# Altium schematic sheet BMS_Cell.SchDoc: CELL BALANCE
size A2; CompanyName: TAISAT; DrawnBy: Alperen Fenerci; Organization: GREENGUARD; SheetNumber: 1; SheetTotal: 2
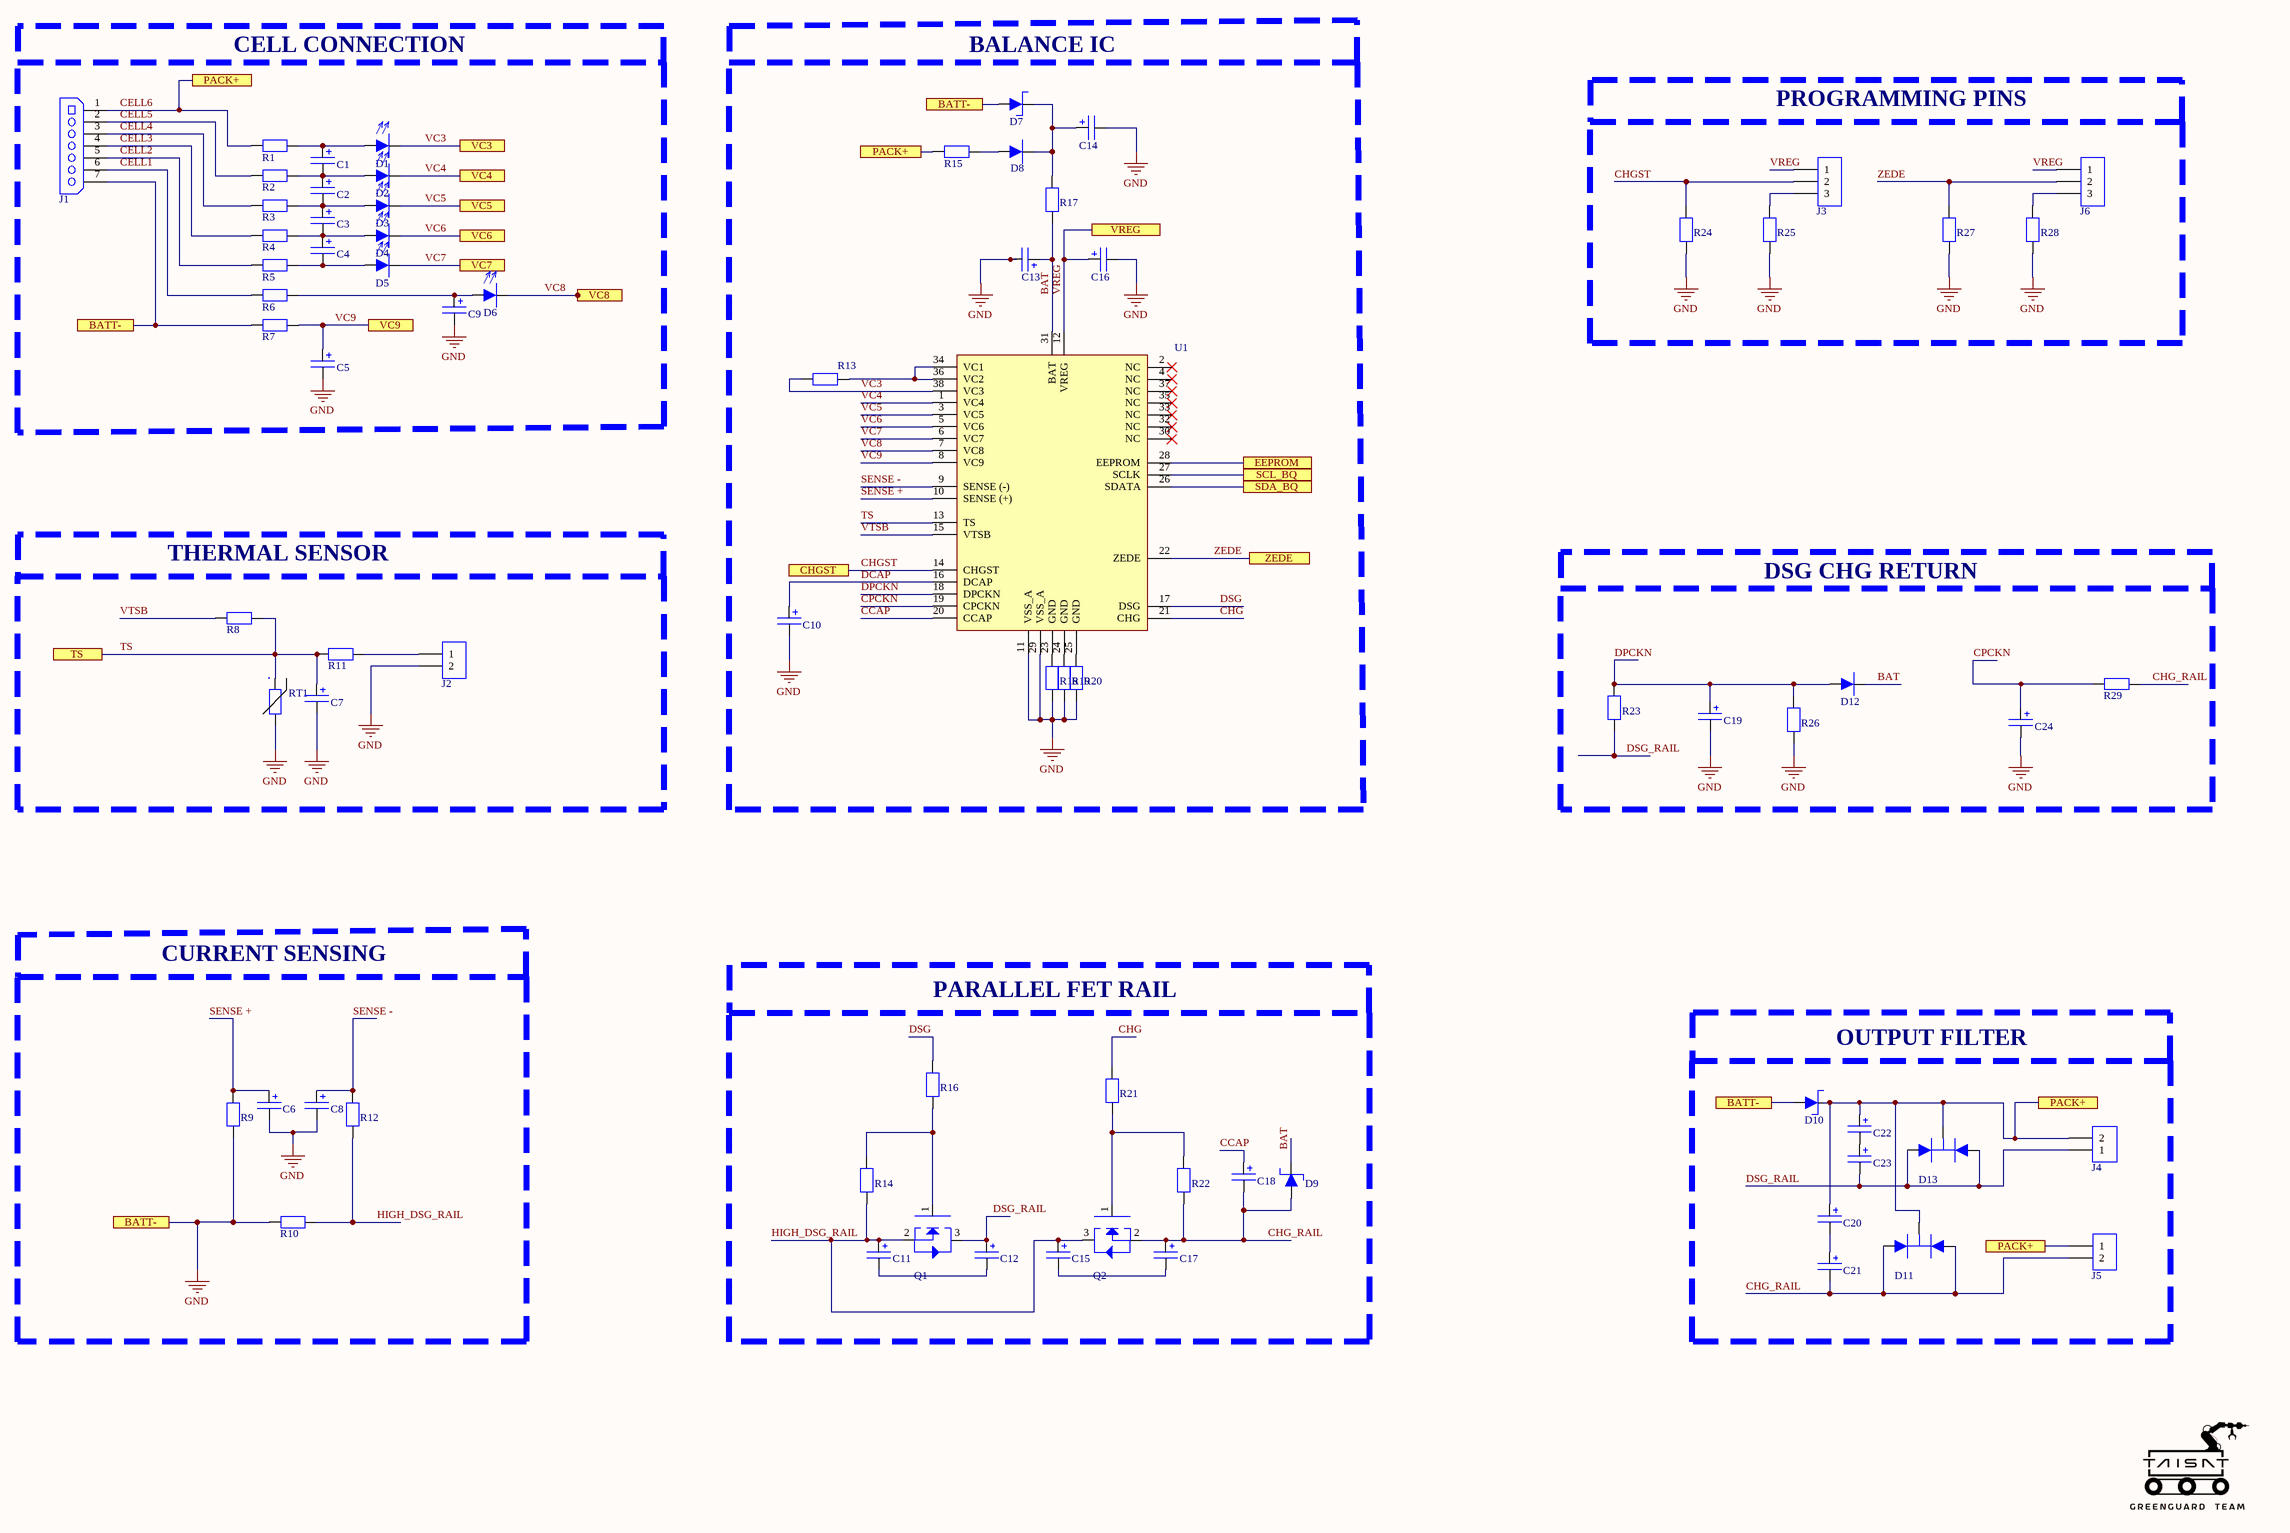
[diagram p0: BMS_Cell.SchDoc]

## Parts
C1  1uF  [CAP 0805]  (value not drawn)
C2  1uF  [CAP 0805]  (value not drawn)
C3  1uF  [CAP 0805]  (value not drawn)
C4  1uF  [CAP 0805]  (value not drawn)
C5  1uF  [CAP 0805]  (value not drawn)
C6  0.1uF  [CAP 0603]  (value not drawn)
C7  10nF  [CAP 0603]  (value not drawn)
C8  0.1uF  [CAP 0603]  (value not drawn)
C9  1uF  [CAP 0805]  (value not drawn)
C10  1uF  [CAP 0603]  (value not drawn)
C11  0.1uF  [CAP 0603]  (value not drawn)
C12  0.1uF  [CAP 0603]  (value not drawn)
C13  0.1uF  [CAP 0603]  (value not drawn)
C14  10uF  [CAP 0603]  (value not drawn)
C15  0.1uF  [CAP 0603]  (value not drawn)
C16  4.7uF  [CAP 0603]  (value not drawn)
C17  0.1uF  [CAP 0603]  (value not drawn)
C18  1uF  [CAP 0603]  (value not drawn)
C19  0.1uF  [CAP 0603]  (value not drawn)
C20  0.1uF  [CAP 0603]  (value not drawn)
C21  0.1uF  [CAP 0603]  (value not drawn)
C22  0.1uF  [CAP 0603]  (value not drawn)
C23  0.1uF  [CAP 0603]  (value not drawn)
C24  0.1uF  [CAP 0603]  (value not drawn)
D1  LTW-C191TLA  [LED 0603]  (value not drawn)
D2  LTW-C191TLA  [LED 0603]  (value not drawn)
D3  LTW-C191TLA  [LED 0603]  (value not drawn)
D4  LTW-C191TLA  [LED 0603]  (value not drawn)
D5  LTW-C191TLA  [LED 0603]  (value not drawn)
D6  LTW-C191TLA  [LED 0603]  (value not drawn)
D7  SMAJ36A-HT  [DO214AC]  (value not drawn)
D8  1N4148WS-HT  [SOD323]  (value not drawn)
D9  SMAJ36A-HT  [DO214AC]  (value not drawn)
D10  SMAJ36A-HT  [DO214AC]  (value not drawn)
D11  BYQ28ED  [DPAK]  (value not drawn)
D12  1N4148WS-HT  [SOD323]  (value not drawn)
D13  BYQ28ED  [DPAK]  (value not drawn)
J1  JST-XH-7  [JST-XH-7]  (value not drawn)
J2  146285-2  [HEADER 1x2]  (value not drawn)
J3  146285-3  [HEADER 1x3]  (value not drawn)
J4  282845-2  [Terminal 1x2]  (value not drawn)
J5  282845-2  [Terminal 1x2]  (value not drawn)
J6  146285-3  [HEADER 1x3]  (value not drawn)
Q1  IRF540SPBF  [D2PAK-3]  (value not drawn)
Q2  IRF540SPBF  [D2PAK-3]  (value not drawn)
R1  500R  [RESISTOR 1206]  (value not drawn)
R2  500R  [RESISTOR 1206]  (value not drawn)
R3  500R  [RESISTOR 1206]  (value not drawn)
R4  500R  [RESISTOR 1206]  (value not drawn)
R5  500R  [RESISTOR 1206]  (value not drawn)
R6  500R  [RESISTOR 1206]  (value not drawn)
R7  500R  [RESISTOR 1206]  (value not drawn)
R8  10K  [RESISTOR 0603]  (value not drawn)
R9  1K  [RESISTOR 0603]  (value not drawn)
R10  0.002R Shunt  [RESISTOR 2512]  (value not drawn)
R11  50R  [RESISTOR 0603]  (value not drawn)
R12  1K  [RESISTOR 0603]  (value not drawn)
R13  100R  [RESISTOR 0603]  (value not drawn)
R14  5.1M  [RESISTOR 0603]  (value not drawn)
R15  200R  [RESISTOR 0603]  (value not drawn)
R16  1K  [RESISTOR 0603]  (value not drawn)
R17  100R  [RESISTOR 0603]  (value not drawn)
R18  1K  [RESISTOR 0603]  (value not drawn)
R19  1K  [RESISTOR 0603]  (value not drawn)
R20  1K  [RESISTOR 0603]  (value not drawn)
R21  1K  [RESISTOR 0603]  (value not drawn)
R22  5.1M  [RESISTOR 0603]  (value not drawn)
R23  100R  [RESISTOR 0603]  (value not drawn)
R24  1K  [RESISTOR 0603]  (value not drawn)
R25  1K  [RESISTOR 0603]  (value not drawn)
R26  47K  [RESISTOR 0603]  (value not drawn)
R27  1K  [RESISTOR 0603]  (value not drawn)
R28  1K  [RESISTOR 0603]  (value not drawn)
R29  100R  [RESISTOR 0603]  (value not drawn)
RT1  10K  [NTC 0603]  (value not drawn)
U1  BQ77908  [TSSOP-38]  (value not drawn)

## Ports
BATT- (see BMS_Cell[2B], BMS_Cell[2C], BMS_Cell[4A]), BATT- (see BMS_Cell[2B], BMS_Cell[2C], BMS_Cell[7C]), BATT- (see BMS_Cell[2B], BMS_Cell[4A], BMS_Cell[7C]), BATT- (see BMS_Cell[2C], BMS_Cell[4A], BMS_Cell[7C]), CHGST (see BMS_MCU[6A]), EEPROM (see BMS_MCU[6A]), PACK+ (see BMS_Cell[2A], BMS_Cell[4A], BMS_Cell[7C], BMS_MCU[1A], BMS_MCU[1B], BMS_MCU[1C]), PACK+ (see BMS_Cell[2A], BMS_Cell[4A], BMS_Cell[7D], BMS_MCU[1A], BMS_MCU[1B], BMS_MCU[1C]), PACK+ (see BMS_Cell[2A], BMS_Cell[7C], BMS_Cell[7D], BMS_MCU[1A], BMS_MCU[1B], BMS_MCU[1C]), PACK+ (see BMS_Cell[4A], BMS_Cell[7C], BMS_Cell[7D], BMS_MCU[1A], BMS_MCU[1B], BMS_MCU[1C]), SCL_BQ (see BMS_MCU[6A]), SDA_BQ (see BMS_MCU[6A]), TS, VC3 (see BMS_MCU[1A]), VC4 (see BMS_MCU[1A]), VC5 (see BMS_MCU[1A]), VC6 (see BMS_MCU[1A], BMS_MCU[1B]), VC7 (see BMS_MCU[1B]), VC8 (see BMS_MCU[1B]), VC9 (see BMS_MCU[1B]), VREG, ZEDE (see BMS_MCU[6A])

## Nets
GND: C5.2 C6.2 C7.2 C8.2 C9.2 C10.2 C13.2 C14.2 C16.2 C19.2 C24.2 D7.2 D10.2 J1.7 J2.2 R7.1 R9.1 R10.1 R18.1 R19.1 R20.1 R24.1 R25.1 R26.1 R27.1 R28.1 RT1.2 U1.11(VSS_A) U1.29(VSS_A) ; port BATT-
BAT: C13.1 D9.1 D12.1 R17.1 U1.31(BAT)
CCAP: C18.1 U1.20(CCAP)
CELL1: J1.6 R6.1
CELL2: J1.5 R5.1
CELL3: J1.4 R4.1
CELL4: J1.3 R3.1
CELL5: J1.2 R2.1
CELL6: C20.1 C22.1 D10.1 D11.2(K) D13.2(K) J1.1 J4.2 J5.1 R1.1 R15.2 ; port PACK+
CHG: R21.2 U1.21(CHG)
CHG_RAIL: C17.1 C18.2 C21.2 D9.2 D11.1(A1) D11.3(A2) J5.2 Q2.2(S) R22.1 R29.1
CHGST: J3.2 R24.2 U1.14(CHGST) ; port CHGST
CPCKN: C24.1 R29.2 U1.19(CPCKN)
DCAP: C10.1 U1.16(DCAP)
DPCKN: C19.1 D12.2 R23.2 R26.2 U1.18(DPCKN)
DSG: R16.2 U1.17(DSG)
DSG_RAIL: C12.1 C23.2 D13.1(A1) D13.3(A2) J4.1 Q1.3(D) R23.1
EEPROM: U1.28(EEPROM) ; port EEPROM
HIGH_DSG_RAIL: C11.1 C15.1 Q1.2(S) Q2.3(D) R10.2 R12.1 R14.1
SCL_BQ: U1.27(SCLK) ; port SCL_BQ
SDA_BQ: U1.26(SDATA) ; port SDA_BQ
SENSE +: C6.1 R9.2 U1.10(SENSE_(+))
SENSE -: C8.1 R12.2 U1.9(SENSE_(-))
TS: C7.1 R8.2 R11.1 RT1.1 U1.13(TS) ; port TS
VC3: D1.1 R13.1 U1.38(VC3) ; port VC3
VC4: D2.1 U1.1(VC4) ; port VC4
VC5: D3.1 U1.3(VC5) ; port VC5
VC6: D4.1 U1.5(VC6) ; port VC6
VC7: D5.1 U1.6(VC7) ; port VC7
VC8: D6.1 U1.7(VC8) ; port VC8
VC9: C5.1 R7.2 U1.8(VC9) ; port VC9
VREG: C16.1 J3.1 J6.1 U1.12(VREG) ; port VREG
VTSB: R8.1 U1.15(VTSB)
ZEDE: J6.2 R27.2 U1.22(ZEDE) ; port ZEDE
NetC1_1: C1.1 D1.2 R1.2
NetC1_2: C1.2 C2.1 D2.2 R2.2
NetC2_2: C2.2 C3.1 D3.2 R3.2
NetC3_2: C3.2 C4.1 D4.2 R4.2
NetC4_2: C4.2 D5.2 R5.2
NetC9_1: C9.1 D6.2 R6.2
NetC11_2: C11.2 C12.2
NetC14_1: C14.1 D7.1 D8.1 R17.2
NetC15_2: C15.2 C17.2
NetC20_2: C20.2 C21.1
NetC22_2: C22.2 C23.1
NetD8_2: D8.2 R15.1
NetJ2_1: J2.1 R11.2
NetJ3_3: J3.3 R25.2
NetJ6_3: J6.3 R28.2
NetQ1_1: Q1.1(G) R14.2 R16.1
NetQ2_1: Q2.1(G) R21.1 R22.2
NetR13_2: R13.2 U1.34(VC1) U1.36(VC2)
NetR18_2: R18.2 U1.23(GND)
NetR19_2: R19.2 U1.24(GND)
NetR20_2: R20.2 U1.25(GND)

Not connected (* = marked no-connect by the designer): U1 2(NC)* 4(NC)* 30(NC)* 32(NC)* 33(NC)* 35(NC)* 37(NC)*

## Notes on the sheet
- CELL CONNECTION
- BALANCE IC
- PROGRAMMING PINS
- THERMAL SENSOR
- DSG CHG RETURN
- CURRENT SENSING
- PARALLEL FET RAIL
- OUTPUT FILTER
- Proje Adı / Project Name
- Dosya Adı / File Name
- Sayfa Adı / Sheet Name
- Şirket Adı / Company Name
- Tasarlayan / Designed By
- Takım / Team
- Kontrol Eden / Checked By
- Başlangıç Tarihi / Start Date
- Revize Tarihi / Revision Date
- Onaylayan / Approved By
- Sayfa / Sheet

## Library data of the parts
C1-C5 C9 = CAP 0805: Multilayer Ceramic Capacitor; Manufacturer: KEMET; Manufacturer Part Number: C0805C224K5RACTU; Material: 4241ConductorMaterial; Value: 220nF; Voltage Rating: 50V; Tolerance: 10%; Dielectric: X7R; Dissipation Factor: 2.5%; Temperature Coefficient: 30ppm/°C; Supplier: Mouser; Supplier Part Number: 80-C0805C224K5R; RoHS: Yes; Category: Ceramic Capacitors; Stock: 89467; Pricing: 1=0.15, 10=0.084, 50=0.084, 100=0.053, 1000=0.035, 10000=0.026 (USD); Mounting Technology: Surface Mount,PCB; Case/Package: 0805; Case Code (Metric): 2012; Case Code (Imperial): 0805; Dielectric Material: Ceramic; Min Operating Temperature: -55°C; Max Operating Temperature: 125°C; Package Quantity: 4000; Packaging: Tape and Reel; Voltage Rating (DC): 50V; Termination: SMD/SMT; Series: SMD Comm X7R; Construction: Flat; Voltage: 50V; Length: 2mm; Width: 1.2mm; Height: 1.1mm; Depth: 1.25mm; Lead Pitch: 0.75mm; Radiation Hardening: No; RoHS Compliant: Yes; Reach SVHC Compliant: No; Lead Free: 5697LeadFree; Created By: Kaptanyum
C6 C8 C10-C24 = CAP 0603: Multilayer Ceramic Capacitor; Manufacturer: KEMET; Manufacturer Part Number: C0603C103K5RACTU; Material: 4241ConductorMaterial; Value: 10nF; Tolerance: 10%; Voltage Rating: 50V; Dielectric: X7R; Dissipation Factor: 2.5%; Temperature Coefficient: 30ppm/°C; Supplier: Mouser; Supplier Part Number: 80-C0603C103K5R; RoHS: Yes; Category: Ceramic Capacitors; Stock: 1110922; Pricing: 1=0.1, 10=0.047, 50=0.047, 100=0.026, 1000=0.017, 10000=0.012 (USD); Mounting Technology: PCB,Surface Mount; Case/Package: 0603; Pins: 2; Case Code (Metric): 1608; Case Code (Imperial): 0603; Min Operating Temperature: -55°C; Max Operating Temperature: 125°C; Voltage Rating (DC): 50V; Packaging: Tape and Reel; Package Quantity: 4000; Termination: SMD/SMT; Series: C0603C; Construction: Flat; Voltage: 50V; Length: 1.6mm; Width: 0.8mm; Height: 0.8mm; Depth: 0.8mm; Lead Pitch: 0.7mm; Radiation Hardening: No; RoHS Compliant: Yes; Reach SVHC Compliant: No; Lead Free: 5697LeadFree; Created By: Kaptanyum
C7 = CAP 0603: Multilayer Ceramic Capacitor; Manufacturer: KEMET; Manufacturer Part Number: C0603C103K5RACTU; Material: 4241ConductorMaterial; Tolerance: 10%; Voltage Rating: 50V; Dielectric: X7R; Dissipation Factor: 2.5%; Temperature Coefficient: 30ppm/°C; Supplier: Mouser; Supplier Part Number: 80-C0603C103K5R; RoHS: Yes; Category: Ceramic Capacitors; Stock: 1110922; Pricing: 1=0.1, 10=0.047, 50=0.047, 100=0.026, 1000=0.017, 10000=0.012 (USD); Mounting Technology: PCB,Surface Mount; Case/Package: 0603; Pins: 2; Case Code (Metric): 1608; Case Code (Imperial): 0603; Min Operating Temperature: -55°C; Max Operating Temperature: 125°C; Value: 10nF; Voltage Rating (DC): 50V; Packaging: Tape and Reel; Package Quantity: 4000; Termination: SMD/SMT; Series: C0603C; Construction: Flat; Voltage: 50V; Length: 1.6mm; Width: 0.8mm; Height: 0.8mm; Depth: 0.8mm; Lead Pitch: 0.7mm; Radiation Hardening: No; RoHS Compliant: Yes; Reach SVHC Compliant: No; Lead Free: 5697LeadFree; Created By: Kaptanyum
D1-D6 = LED 0603: Chip LED; Manufacturer: Vishay Lite-On; Manufacturer Part Number: LTST-C190GKT; Color: Green; Lens Color: Colorless; Luminous Intensity: 6mcd; Forward Voltage: 2.1V; Viewing Angle: 130°; Lens Style: Flat,Diffused,Colorless,Rectangular,Clear; Forward Current: 30mA; Dominant Wavelength: 569nm; Test Current: 10mA; Wavelength: 565nm; Power Dissipation: 100mW; Number of LEDs: 1; Reverse Voltage: 5V; Lens Transparency: Clear; Voltage: 2V; Lens Size: 0.8mm; Supplier: Arrow Electronics; Supplier Part Number: LTST-C190GKT; RoHS: Yes; Category: LEDs; Stock: 36000; Pricing: 4000=0.0455, 12000=0.034, 100000=0.0267 (USD); Mounting Technology: Surface Mount; Case/Package: 0603; Pins: 2; Case Code (Metric): 1608; Case Code (Imperial): 0603; Min Operating Temperature: -55°C; Max Operating Temperature: 85°C; Packaging: Tape and Reel; Package Quantity: 1; Series: -; Illumination Color: Green; Power Rating: 100mW; Number of Elements: 1; Length: 1.6mm; Width: 0.8mm; Height: 0.9mm; Depth: 0.8mm; Radiation Hardening: No; Lead Free: Lead Free; RoHS Compliant: Yes; ComponentLink1URL: https://datasheet.ciiva.com/2109/ltst-c190gkt-2109985.pdf?src-supplier=Digi-Key; ComponentLink1Description: https://datasheet.ciiva.com/2109/ltst-c190gkt-2109985.pdf?src-supplier=Digi-Key; ComponentLink2URL: https://datasheet.ciiva.com/11775/0900766b80dc02a6-11775616.pdf?src-supplier=Rs; ComponentLink2Description: https://datasheet.ciiva.com/11775/0900766b80dc02a6-11775616.pdf?src-supplier=Rs; ComponentLink3URL: https://datasheet.ciiva.com/12403/lite-on-ltst-c190gkt-187204-12403884.pdf?src-supplier=Mouser; ComponentLink3Description: https://datasheet.ciiva.com/12403/lite-on-ltst-c190gkt-187204-12403884.pdf?src-supplier=Mouser; ComponentLink4URL: https://datasheet.ciiva.com/16392/lite-on20ltst-c190gkt-16392818.pdf?src-supplier=Future+Electronics; ComponentLink4Description: https://datasheet.ciiva.com/16392/lite-on20ltst-c190gkt-16392818.pdf?src-supplier=Future+Electronics; ComponentLink5URL: https://datasheet.ciiva.com/2109/ltst-c190gkt-2109986.pdf?src-supplier=Digi-Key; ComponentLink5Description: https://datasheet.ciiva.com/2109/ltst-c190gkt-2109986.pdf?src-supplier=Digi-Key; ComponentLink6URL: https://datasheet.ciiva.com/2109/ltst-c190gkt-2109987.pdf?src-supplier=Digi-Key; ComponentLink6Description: https://datasheet.ciiva.com/2109/ltst-c190gkt-2109987.pdf?src-supplier=Digi-Key; Created By: Kaptanyum
D7 D9 D10 = SMAJ36A-HT: Diode TVS 36V; Manufacturer: Vishay Semiconductors; Manufacturer Part Number: SMAJ36AHE3/61; Peak Pulse Power: 400W; Breakdown Voltage: 40V; Polarity: Unidirectional; Peak Pulse Current: 6.9A; Clamping Voltage: 58.1V; Power Line Protection: No; Diode Type: ZENER; Number of Unidirectional Channels: 1; Test Current: 1mA; Max Breakdown Voltage: 44.2V; Max Reverse Leakage Current: 1uA; Max Forward Surge Current (Ifsm): 40A; Supplier: Digi-Key; Supplier Part Number: SMAJ36AHE3/61DKR-ND; RoHS: Yes; Category: TVS Diodes; Case/Package: DO-214AC; Pins: 2; Min Operating Temperature: -55°C; Max Operating Temperature: 150°C; Packaging: Tape and Reel; Reverse Standoff Voltage: 36V; Min Breakdown Voltage: 40V; Package Quantity: 1800; Max Surge Current: 6.9A; Series: Automotive, AEC-Q101, TransZorb®; Termination: SMD/SMT; Max Power Dissipation: 400W; Operating Supply Voltage: 36V; Number of Channels: 1; Direction: Unidirectional; Power Dissipation: 400W; Clamping Voltage-Max: 58.1V; RoHS Compliant: Yes; Lead Free: Lead Free; ComponentLink1URL: http://www.mouser.com/ds/2/427/smaj50a-241759.pdf?src-supplier=Mouser; ComponentLink1Description: http://www.mouser.com/ds/2/427/smaj50a-241759.pdf?src-supplier=Mouser; ComponentLink2URL: http://www.vishay.com/docs/88390/smaj50a.pdf?src-supplier=Digi-Key; ComponentLink2Description: http://www.vishay.com/docs/88390/smaj50a.pdf?src-supplier=Digi-Key; ComponentLink3URL: http://www.vishay.com/docs/88390/88390.pdf?src-supplier=Avnet; ComponentLink3Description: http://www.vishay.com/docs/88390/88390.pdf?src-supplier=Avnet; ComponentLink4URL: http://www.vishay.com/doc?88390?src-supplier=Future+Electronics; ComponentLink4Description: http://www.vishay.com/doc?88390?src-supplier=Future+Electronics
D8 D12 = 1N4148WS-HT: Diode Switch 75V
D11 D13 = BYQ28ED: Diode Array Rectifier; Manufacturer: NXP Semiconductors; Manufacturer Part Number: BYQ28ED-200/T3; Max Reverse Current: 10uA; Max Surge Current: 55A; Recovery Time: 25ns; Reverse Voltage: 200V; Supplier: Mouser; Supplier Part Number: 771-BYQ28ED-200/T3; RoHS: Yes; Category: Uncategorized; Case/Package: DPAK; Min Operating Temperature: -40°C; Max Operating Temperature: 150°C; Packaging: Tape and Reel; Package Quantity: 2500; RoHS Compliant: Yes; ComponentLink1URL: http://www.nxp.com/pip/BYQ28ED-200?src-supplier=Mouser; ComponentLink1Description: http://www.nxp.com/pip/BYQ28ED-200?src-supplier=Mouser; Created By: Kaptanyum
J1 = JST-XH-7: JST Socket for PCB; Manufacturer Part Number: B4B-XH-A(LF)(SN); Gender: Male; Contact Resistance: 20mR; Max Current Rating: 3A; Voltage Rating: 250V; Number of Positions: 4; Connector Type: Header; Insulation Resistance: 1GR; Pitch: 2.5mm; Mated Stacking Heights: 9.8mm; Wire/Cable Gauge: 22AWG; Supplier: Arrow Electronics; Supplier Part Number: B4B-XH-A(LF)(SN); Manufacturer: JST; RoHS: Yes; Category: Headers and Wire Housings; Stock: 46264; Pricing: 1=0.1585, 10=0.1388, 25=0.1373, 50=0.1359, 100=0.0728 (USD); Mounting Technology: Through Hole; Contact Plating: Tin,Lead,Copper; Contact Material: Brass; Housing Color: White; Housing Material: Polyamide; Contact Shape: Square; Contact Finish - Mating: TIN; Insulation Material: Nylon; Insulation Color: Natural; Color: Natural; Material: Polyamide; Min Operating Temperature: -25°C; Max Operating Temperature: 85°C; Number of Rows: 1; Termination: Solder; Series: XH; Packaging: Bulk; Max Voltage Rating (AC): 250V; Number of Contacts: 4; Orientation: Straight; Contact Type: Male Pin; Fastening Type: Detent; Current Rating: 3A; Voltage Rating (AC): 250V; Max Voltage Rating (DC): 250V; Length: 12.4mm; Depth: 5.75mm; Lead Pitch: 2.5mm; Reach SVHC Compliant: No; Lead Free: Lead Free; Flammability Rating: UL94 V-0; ComponentLink1URL: https://datasheet.ciiva.com/16203/b4b-xh-alfsn-16203642.pdf?src-supplier=Future+Electronics; ComponentLink1Description: https://datasheet.ciiva.com/16203/b4b-xh-alfsn-16203642.pdf?src-supplier=Future+Electronics; ComponentLink2URL: https://datasheet.ciiva.com/26894/getdatasheetpartid-455616-26894787.pdf?src-supplier=Verical; ComponentLink2Description: https://datasheet.ciiva.com/26894/getdatasheetpartid-455616-26894787.pdf?src-supplier=Verical; ComponentLink3URL: https://datasheet.ciiva.com/26924/getdatasheetpartid-640571-26924035.pdf?src-supplier=Verical; ComponentLink3Description: https://datasheet.ciiva.com/26924/getdatasheetpartid-640571-26924035.pdf?src-supplier=Verical; ComponentLink4URL: https://datasheet.ciiva.com/726/exh-726404.pdf?src-supplier=Digi-Key; ComponentLink4Description: https://datasheet.ciiva.com/726/exh-726404.pdf?src-supplier=Digi-Key; Created By: Kaptanyum
J2 = HEADER 1x2: Header for PCB; Manufacturer: JST; Manufacturer Part Number: B4B-XH-A(LF)(SN); Gender: Male; Contact Resistance: 20mR; Max Current Rating: 3A; Voltage Rating: 250V; Number of Positions: 4; Insulation Resistance: 1GR; Pitch: 2.5mm; Mated Stacking Heights: 9.8mm; Wire/Cable Gauge: 22AWG; Supplier: Arrow Electronics; Supplier Part Number: B4B-XH-A(LF)(SN); RoHS: Yes; Category: Headers and Wire Housings; Stock: 46264; Pricing: 1=0.1585, 10=0.1388, 25=0.1373, 50=0.1359, 100=0.0728 (USD); Mounting Technology: Through Hole; Contact Plating: Tin,Lead,Copper; Contact Material: Brass; Housing Color: White; Housing Material: Polyamide; Contact Shape: Square; Contact Finish - Mating: TIN; Insulation Material: Nylon; Insulation Color: Natural; Color: Natural; Material: Polyamide; Min Operating Temperature: -25°C; Max Operating Temperature: 85°C; Number of Rows: 1; Termination: Solder; Series: XH; Packaging: Bulk; Max Voltage Rating (AC): 250V; Number of Contacts: 4; Orientation: Straight; Connector Type: Header; Contact Type: Male Pin; Fastening Type: Detent; Current Rating: 3A; Voltage Rating (AC): 250V; Max Voltage Rating (DC): 250V; Length: 12.4mm; Depth: 5.75mm; Lead Pitch: 2.5mm; Reach SVHC Compliant: No; Lead Free: Lead Free; Flammability Rating: UL94 V-0; ComponentLink1URL: https://datasheet.ciiva.com/16203/b4b-xh-alfsn-16203642.pdf?src-supplier=Future+Electronics; ComponentLink1Description: https://datasheet.ciiva.com/16203/b4b-xh-alfsn-16203642.pdf?src-supplier=Future+Electronics; ComponentLink2URL: https://datasheet.ciiva.com/26894/getdatasheetpartid-455616-26894787.pdf?src-supplier=Verical; ComponentLink2Description: https://datasheet.ciiva.com/26894/getdatasheetpartid-455616-26894787.pdf?src-supplier=Verical; ComponentLink3URL: https://datasheet.ciiva.com/26924/getdatasheetpartid-640571-26924035.pdf?src-supplier=Verical; ComponentLink3Description: https://datasheet.ciiva.com/26924/getdatasheetpartid-640571-26924035.pdf?src-supplier=Verical; ComponentLink4URL: https://datasheet.ciiva.com/726/exh-726404.pdf?src-supplier=Digi-Key; ComponentLink4Description: https://datasheet.ciiva.com/726/exh-726404.pdf?src-supplier=Digi-Key; Created By: Kaptanyum
J3 J6 = HEADER 1x3: Header for PCB; Manufacturer: JST; Manufacturer Part Number: B4B-XH-A(LF)(SN); Gender: Male; Contact Resistance: 20mR; Max Current Rating: 3A; Voltage Rating: 250V; Number of Positions: 4; Insulation Resistance: 1GR; Pitch: 2.5mm; Mated Stacking Heights: 9.8mm; Wire/Cable Gauge: 22AWG; Supplier: Arrow Electronics; Supplier Part Number: B4B-XH-A(LF)(SN); RoHS: Yes; Category: Headers and Wire Housings; Stock: 46264; Pricing: 1=0.1585, 10=0.1388, 25=0.1373, 50=0.1359, 100=0.0728 (USD); Mounting Technology: Through Hole; Contact Plating: Tin,Lead,Copper; Contact Material: Brass; Housing Color: White; Housing Material: Polyamide; Contact Shape: Square; Contact Finish - Mating: TIN; Insulation Material: Nylon; Insulation Color: Natural; Color: Natural; Material: Polyamide; Min Operating Temperature: -25°C; Max Operating Temperature: 85°C; Number of Rows: 1; Termination: Solder; Series: XH; Packaging: Bulk; Max Voltage Rating (AC): 250V; Number of Contacts: 4; Orientation: Straight; Connector Type: Header; Contact Type: Male Pin; Fastening Type: Detent; Current Rating: 3A; Voltage Rating (AC): 250V; Max Voltage Rating (DC): 250V; Length: 12.4mm; Depth: 5.75mm; Lead Pitch: 2.5mm; Reach SVHC Compliant: No; Lead Free: Lead Free; Flammability Rating: UL94 V-0; ComponentLink1URL: https://datasheet.ciiva.com/16203/b4b-xh-alfsn-16203642.pdf?src-supplier=Future+Electronics; ComponentLink1Description: https://datasheet.ciiva.com/16203/b4b-xh-alfsn-16203642.pdf?src-supplier=Future+Electronics; ComponentLink2URL: https://datasheet.ciiva.com/26894/getdatasheetpartid-455616-26894787.pdf?src-supplier=Verical; ComponentLink2Description: https://datasheet.ciiva.com/26894/getdatasheetpartid-455616-26894787.pdf?src-supplier=Verical; ComponentLink3URL: https://datasheet.ciiva.com/26924/getdatasheetpartid-640571-26924035.pdf?src-supplier=Verical; ComponentLink3Description: https://datasheet.ciiva.com/26924/getdatasheetpartid-640571-26924035.pdf?src-supplier=Verical; ComponentLink4URL: https://datasheet.ciiva.com/726/exh-726404.pdf?src-supplier=Digi-Key; ComponentLink4Description: https://datasheet.ciiva.com/726/exh-726404.pdf?src-supplier=Digi-Key; Created By: Kaptanyum
J4 J5 = SCREW TERMINAL: 7.62mm 2 POS; Created By: Kaptanyum
Q1 Q2 = IRF540SPBF: MOSFET N-ch, 100V 28A
R1-R7 = RES 1206: SMD Chip Resistor; Manufacturer: Yageo; Manufacturer Part Number: RC1206FR-074K7L; Voltage Rating: 200V; Value: 4.7kR; Power Rating: 250mW; Temperature Coefficient: 100ppm/°C; Tolerance: 1%; Supplier: Future Electronics; Supplier Part Number: 2668689; RoHS: Yes; Category: Chip SMD Resistors; Stock: 240000; Pricing: 5000=0.0048, 25000=0.0045, 100000=0.0043, 250000=0.0041, 625000=0.0038 (USD); Case/Package: 1206; Pins: 2; Case Code (Imperial): 1206; Case Code (Metric): 3216; Min Operating Temperature: -55°C; Max Operating Temperature: 155°C; Packaging: Tape and Reel; Resistor Type: Thick Film; Voltage Rating (DC): 200V; Series: RC02H; Resistance Tolerance: 1%; Voltage Rating (AC): 200V; Width: 1.6mm; RoHS Compliant: Yes; Reach SVHC Compliant: Unknown; Lead Free: Lead Free; Created By: Kaptanyum
R8 R9 R11-R29 = RES 0603: SMD Chip Resistor; Manufacturer: Yageo; Manufacturer Part Number: AC0603FR-071KL; Tolerance: 1%; Value: 1kR; Power Rating: 100mW; Voltage Rating: 50V; Temperature Coefficient: 100ppm/°C; Supplier: Future Electronics; Supplier Part Number: 1029290; RoHS: Yes; Category: Chip SMD Resistors; Stock: 1025000; Pricing: 5000=0.0021, 25000=0.0019, 150000=0.0018, 500000=0.0017, 1500000=0.0016 (USD); Case/Package: 0603; Case Code (Metric): 1608; Case Code (Imperial): 0603; Min Operating Temperature: -55°C; Max Operating Temperature: 155°C; Packaging: Tape and Reel; Package Quantity: 1; Number of Terminations: 2; Termination: SMD/SMT; Max Power Dissipation: 100mW; Features: Moisture Resistant,Automotive AEC-Q200,Anti-Sulfur; Series: AC; Length: 0.063inch; Width: 0.031inch; Height: 0.022inch; Ratings: AEC-Q200; Lead Free: Lead Free; RoHS Compliant: Yes; ComponentLink1URL: https://datasheet.ciiva.com/5558/pyu-ac-51-rohs-l-2-5558269.pdf?src-supplier=Mouser; ComponentLink1Description: https://datasheet.ciiva.com/5558/pyu-ac-51-rohs-l-2-5558269.pdf?src-supplier=Mouser; Created By: Kaptanyum
R10 = RES 2512: SMD Chip Resistor; Manufacturer: Yageo; Manufacturer Part Number: RC1206FR-074K7L; Voltage Rating: 200V; Value: 4.7kR; Power Rating: 250mW; Temperature Coefficient: 100ppm/°C; Tolerance: 1%; Supplier: Future Electronics; Supplier Part Number: 2668689; RoHS: Yes; Category: Chip SMD Resistors; Stock: 240000; Pricing: 5000=0.0048, 25000=0.0045, 100000=0.0043, 250000=0.0041, 625000=0.0038 (USD); Case/Package: 1206; Pins: 2; Case Code (Imperial): 1206; Case Code (Metric): 3216; Min Operating Temperature: -55°C; Max Operating Temperature: 155°C; Packaging: Tape and Reel; Resistor Type: Thick Film; Voltage Rating (DC): 200V; Series: RC02H; Resistance Tolerance: 1%; Voltage Rating (AC): 200V; Width: 1.6mm; RoHS Compliant: Yes; Reach SVHC Compliant: Unknown; Lead Free: Lead Free; Created By: Kaptanyum
RT1 = NTC 0603: Thermistor NTC; Manufacturer: Panasonic; Manufacturer Part Number: ERT-J1VG103FA; Value: 10kR; Tolerance: 1%; Max Power Dissipation: 100mW; Supplier: Mouser; Supplier Part Number: 667-ERT-J1VG103FA; RoHS: Yes; Category: Thermistors; Stock: 91891; Pricing: 1=0.2, 10=0.141, 50=0.141, 100=0.12, 1000=0.09, 10000=0.077 (USD); Mounting Technology: Surface Mount; Case/Package: 0603; Pins: 2; Case Code (Metric): 1608; Case Code (Imperial): 0603; Min Operating Temperature: -40°C; Max Operating Temperature: 125°C; Packaging: Tape and Reel; Package Quantity: 4000; Termination: SMD/SMT; Power Rating: 100mW; Series: ERT-J; Resistance Tolerance: 1%; Accuracy: 1%; Length: 1.6mm; Width: 800um; Height: 0.8mm; Depth: 0.8mm; Radiation Hardening: No; Reach SVHC Compliant: No; RoHS Compliant: Yes; Lead Free: 5697LeadFree; Created By: Kaptanyum
U1 = BQ77908: Cell Balance, Cell Monitoring; Manufacturer: Texas Instruments; Manufacturer Part Number: BQ77908ADBTR; Min Supply Voltage: 5.6V; Max Supply Voltage: 35V; Interface: I2C; Fault Protection: Over Current,Over Temperature,Short Circuit,Over/Under Voltage; Supplier: Digi-Key; Supplier Part Number: 296-36571-2-ND; RoHS: Yes; Category: Battery Management; Pricing: 2000=6.86865 (USD); Case/Package: TSSOP; Pins: 38; Contact Plating: Gold; Min Operating Temperature: -25°C; Max Operating Temperature: 85°C; Series: -; Package Quantity: 2000; Packaging: Tape and Reel; Radiation Hardening: No; Lead Free: Lead Free; RoHS Compliant: Yes; ComponentLink1URL: https://datasheet.ciiva.com/29610/bq77908a-29610033.pdf?src-supplier=Digi-Key; ComponentLink1Description: https://datasheet.ciiva.com/29610/bq77908a-29610033.pdf?src-supplier=Digi-Key; ComponentLink2URL: https://datasheet.ciiva.com/3214/bq77908a-3214679.pdf?src-supplier=Avnet; ComponentLink2Description: https://datasheet.ciiva.com/3214/bq77908a-3214679.pdf?src-supplier=Avnet; Created By: Kaptanyum